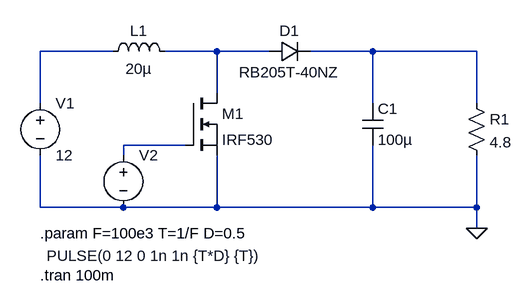
[diagram p0: schematic boost_converter.asc]
boost_converter.asc, the LTspice schematic file:
Version 4.1
SHEET 1 880 680
WIRE -32 48 -144 48
WIRE 128 48 48 48
WIRE 208 48 128 48
WIRE 368 48 272 48
WIRE 528 48 368 48
WIRE 128 112 128 48
WIRE -144 128 -144 48
WIRE 368 128 368 48
WIRE 528 128 528 48
WIRE 80 192 -16 192
WIRE -16 208 -16 192
WIRE -144 288 -144 208
WIRE -16 288 -144 288
WIRE 128 288 128 208
WIRE 128 288 -16 288
WIRE 368 288 368 192
WIRE 368 288 128 288
WIRE 528 288 528 208
WIRE 528 288 368 288
WIRE 528 320 528 288
FLAG 528 320 0
SYMBOL voltage -144 112 R0
WINDOW 123 0 0 Left 0
WINDOW 39 0 0 Left 0
SYMATTR InstName V1
SYMATTR Value 12
SYMBOL ind -48 64 R270
WINDOW 0 32 56 VTop 2
WINDOW 3 5 56 VBottom 2
SYMATTR InstName L1
SYMATTR Value 20µ
SYMBOL diode 208 64 R270
WINDOW 0 32 32 VTop 2
WINDOW 3 0 32 VBottom 2
SYMATTR InstName D1
SYMATTR Value RB205T-40NZ
SYMBOL cap 352 128 R0
SYMATTR InstName C1
SYMATTR Value 100µ
SYMBOL res 512 112 R0
SYMATTR InstName R1
SYMATTR Value 4.8
SYMBOL nmos 80 112 R0
SYMATTR InstName M1
SYMATTR Value IRF530
SYMBOL voltage -16 192 R0
WINDOW 3 -118 170 Left 2
WINDOW 123 0 0 Left 0
WINDOW 39 0 0 Left 0
SYMATTR Value PULSE(0 12 0 1n 1n {T*D} {T})
SYMATTR InstName V2
TEXT -144 328 Left 2 !.param F=100e3 T=1/F D=0.5
TEXT -144 392 Left 2 !.tran 100m

The netlist it stands for:
* boost_converter.asc
V1 N001 0 12
L1 N001 N002 20µ
D1 N002 N003 RB205T-40NZ
C1 N003 0 100µ
R1 N003 0 4.8
M1 N002 N004 0 0 IRF530
V2 N004 0 PULSE(0 12 0 1n 1n {T*D} {T})
.model D D
.lib standard.dio
.model NMOS NMOS
.model PMOS PMOS
.lib standard.mos
.param F=100e3 T=1/F D=0.5
.tran 100m
.backanno
.end